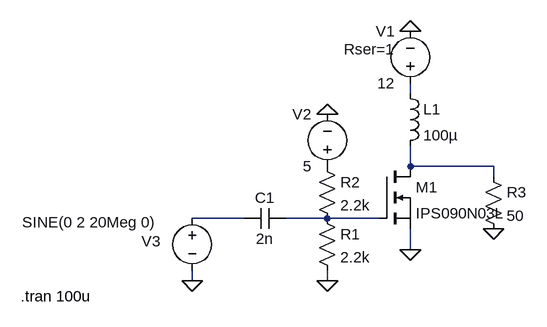
[diagram p0: schematic PA.asc]
PA.asc, the LTspice schematic file:
Version 4
SHEET 1 880 680
WIRE 192 16 192 0
WIRE 192 128 192 96
WIRE 320 128 192 128
WIRE 320 144 320 128
WIRE -64 208 -144 208
WIRE 64 208 0 208
WIRE 144 208 64 208
WIRE 192 256 192 224
WIRE -144 304 -144 288
WIRE 64 304 64 288
FLAG 192 256 0
FLAG 64 304 0
FLAG 192 -80 0
FLAG 64 48 0
FLAG -144 304 0
FLAG 320 224 0
SYMBOL nmos 144 128 R0
SYMATTR InstName M1
SYMATTR Value IPS090N03L
SYMBOL ind 176 0 R0
SYMATTR InstName L1
SYMATTR Value 100µ
SYMBOL cap 0 192 R90
WINDOW 0 0 32 VBottom 2
WINDOW 3 32 32 VTop 2
SYMATTR InstName C1
SYMATTR Value 2n
SYMBOL res 48 192 R0
SYMATTR InstName R1
SYMATTR Value 2.2k
SYMBOL res 48 112 R0
SYMATTR InstName R2
SYMATTR Value 2.2k
SYMBOL voltage 192 16 R180
WINDOW 0 24 96 Left 2
WINDOW 3 24 16 Left 2
WINDOW 123 0 0 Left 0
WINDOW 39 24 68 Left 2
SYMATTR InstName V1
SYMATTR Value 12
SYMATTR SpiceLine Rser=1
SYMBOL voltage 64 144 R180
WINDOW 0 24 96 Left 2
WINDOW 3 24 16 Left 2
WINDOW 123 0 0 Left 0
WINDOW 39 0 0 Left 0
SYMATTR InstName V2
SYMATTR Value 5
SYMBOL voltage -144 192 R0
WINDOW 0 -78 51 Left 2
WINDOW 3 -262 22 Left 2
WINDOW 123 0 0 Left 0
WINDOW 39 0 0 Left 0
SYMATTR InstName V3
SYMATTR Value SINE(0 2 20Meg 0)
SYMBOL res 304 128 R0
SYMATTR InstName R3
SYMATTR Value 50
TEXT -408 328 Left 2 !.tran 100u

The netlist it stands for:
* PA.asc
M1 N002 N004 0 0 IPS090N03L
L1 N001 N002 100µ
C1 N004 N003 2n
R1 N004 0 2.2k
R2 P001 N004 2.2k
V1 N001 0 12 Rser=1
V2 P001 0 5
V3 N003 0 SINE(0 2 20Meg 0)
R3 N002 0 50
.model NMOS NMOS
.model PMOS PMOS
.lib standard.mos
.tran 100u
.backanno
.end